# Altium schematic sheet TEMP_SENSORS.SchDoc
size A4; SheetNumber: 3; SheetTotal: 7
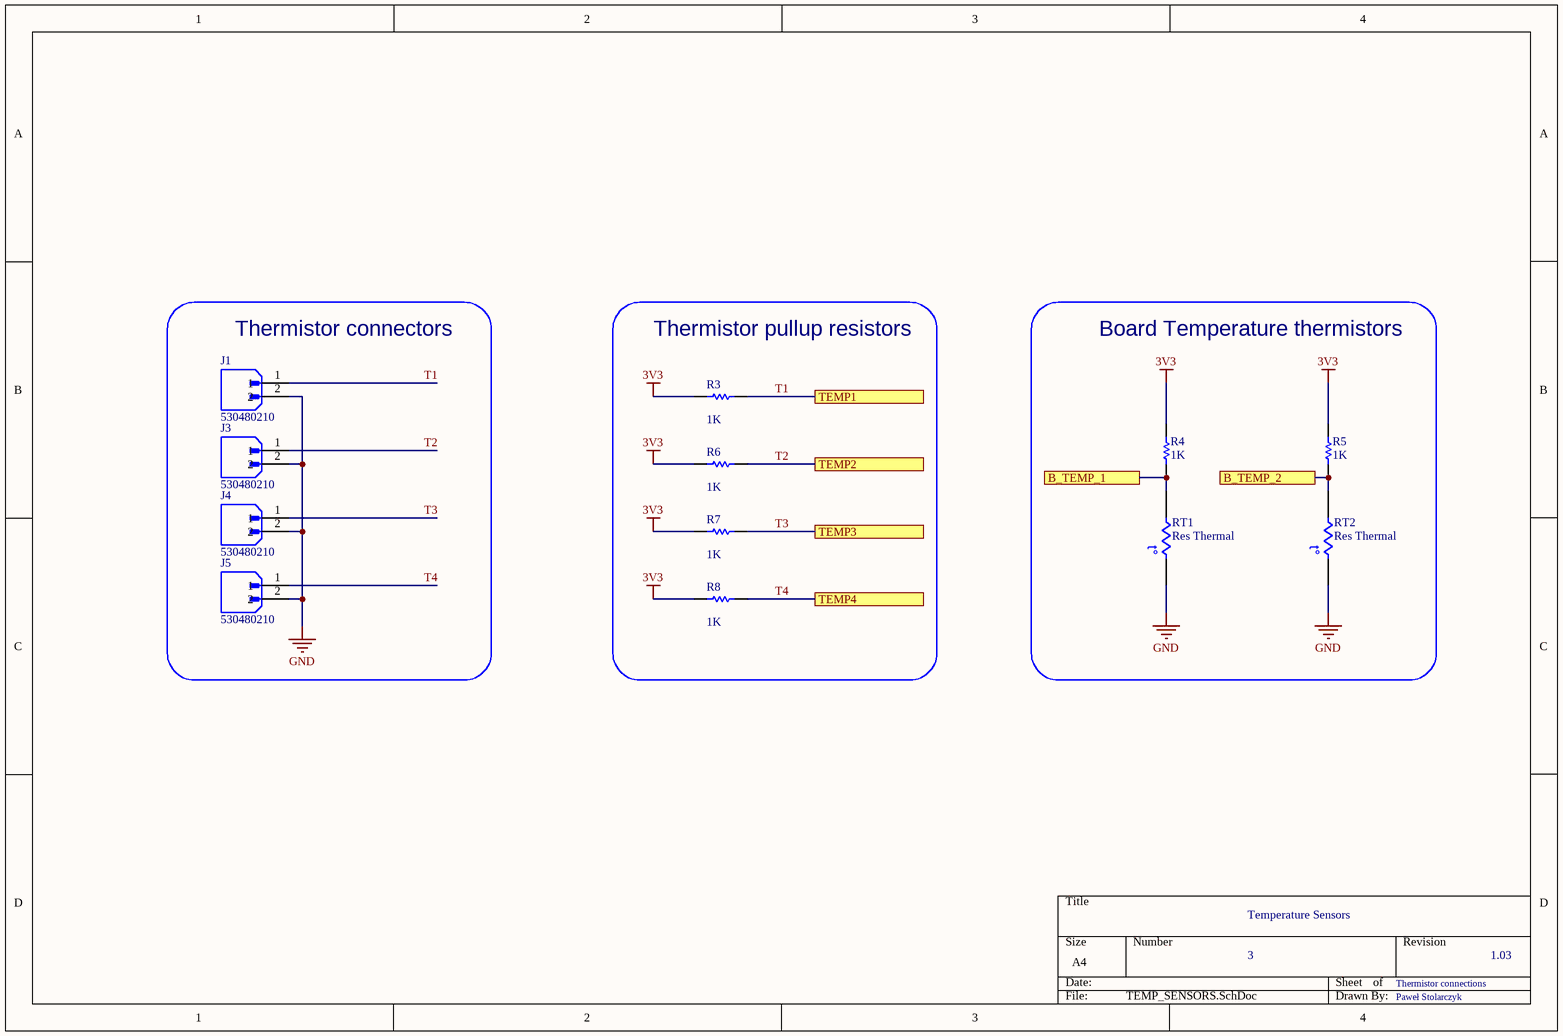
[diagram p0: TEMP_SENSORS.SchDoc]

## Parts
J1  530480210  [MOLEX_530480210]
J3  530480210  [MOLEX_530480210]
J4  530480210  [MOLEX_530480210]
J5  530480210  [MOLEX_530480210]
R3  value 1K  [0402]  (hidden comment: Res1)
R4  value 1K  [0402]  (hidden comment: Res1)
R5  value 1K  [0402]  (hidden comment: Res1)
R6  value 1K  [0402]  (hidden comment: Res1)
R7  value 1K  [0402]  (hidden comment: Res1)
R8  value 1K  [0402]  (hidden comment: Res1)
RT1  Res Thermal  [0402]
RT2  Res Thermal  [0402]

## Blocks framed on the sheet
Thermistor connectors: J1 J3-J5
Thermistor pullup resistors: R3 R6-R8
Board Temperature thermistors: R4 R5 RT1 RT2

## Ports
B_TEMP_1 (see BMS_SLAVE[2C], MCU[2B]), B_TEMP_2 (see BMS_SLAVE[2C], MCU[2C]), TEMP1 (see BMS_SLAVE[2C], MCU[2B]), TEMP2 (see BMS_SLAVE[2C], MCU[2B]), TEMP3 (see BMS_SLAVE[2C], MCU[2B]), TEMP4 (see BMS_SLAVE[2C], MCU[2B])

## Nets
3V3: R3.2 R4.2 R5.2 R6.2 R7.2 R8.2
GND: J1.2 J3.2 J4.2 J5.2 RT1.1 RT2.1
B_TEMP_1: R4.1 RT1.2 ; port B_TEMP_1
B_TEMP_2: R5.1 RT2.2 ; port B_TEMP_2
T1: J1.1 R3.1 ; port TEMP1
T2: J3.1 R6.1 ; port TEMP2
T3: J4.1 R7.1 ; port TEMP3
T4: J5.1 R8.1 ; port TEMP4

## Notes on the sheet
- Temperature Sensors
- 3
- Thermistor connections
- 1.03
- Paweł Stolarczyk
- (in symbol Res Thermal) t°

## Library data of the parts
J1 J3-J5 = 530480210: Conn Shrouded Header (4 Sides) HDR 2 POS 1.25mm Solder RA Side Entry Thru-Hole PicoBladeâ„¢ Tray; MF: Molex; SnapEDA_Link: https://www.snapeda.com/parts/530480210/Molex/view-part/?ref=snap; Value: *; Purchase-URL: https://pricing.snapeda.com/search/part/530480210/?ref=eda; Check_prices: https://www.snapeda.com/parts/530480210/Molex/view-part/?ref=eda; Availability: In Stock; Price: None; MP: 530480210; Package: None
R3-R8 = Res1: Resistor; Published: 8-Jun-2000; LatestRevisionDate: 17-Jul-2002; LatestRevisionNote: Re-released for DXP Platform.; PackageReference: AXIAL-0.3; Publisher: Altium Limited; PackageDescription: Axial Device, Thru-Hole; 2 Leads; 0.3 in Pin Spacing
RT1 RT2 = Res Thermal: Thermistor; Published: 24-Mar-1999; LatestRevisionDate: 29-May-2009; LatestRevisionNote: IPC-7351 Footprint Added.; PackageVersion: Mar-2003; PackageReference: 6-0805; Publisher: Altium Limited; PackageDescription: Chip Resistor 0805 Case Size; Code_IPC: RESC2012